# Altium schematic sheet 02_XEM.SchDoc: XEM Card Edge Connector
size 381 x 266 mm; Organization: Meteroi; Address1: Room 428, 410 Guiping Rd.; Address2: Shanghai 200233, CHINA; SheetNumber: 2; SheetTotal: 10; PageSetup: Record=PageOptions|CenterHorizontal=True|CenterVertical=True|PrintScale=0.75|XCorrection=1.00|YCorrection=1.00|PrintKind=2|BorderSize=5000000|LeftOffset=0|BottomOffset=0|Orientation=2|PaperLength=1000|PaperWidth=1000|Scale=100|PaperSource=276|PrintQuality=-3|MediaType=1|DitherType=10|PaperKind=A4|PrintScaleMode=1
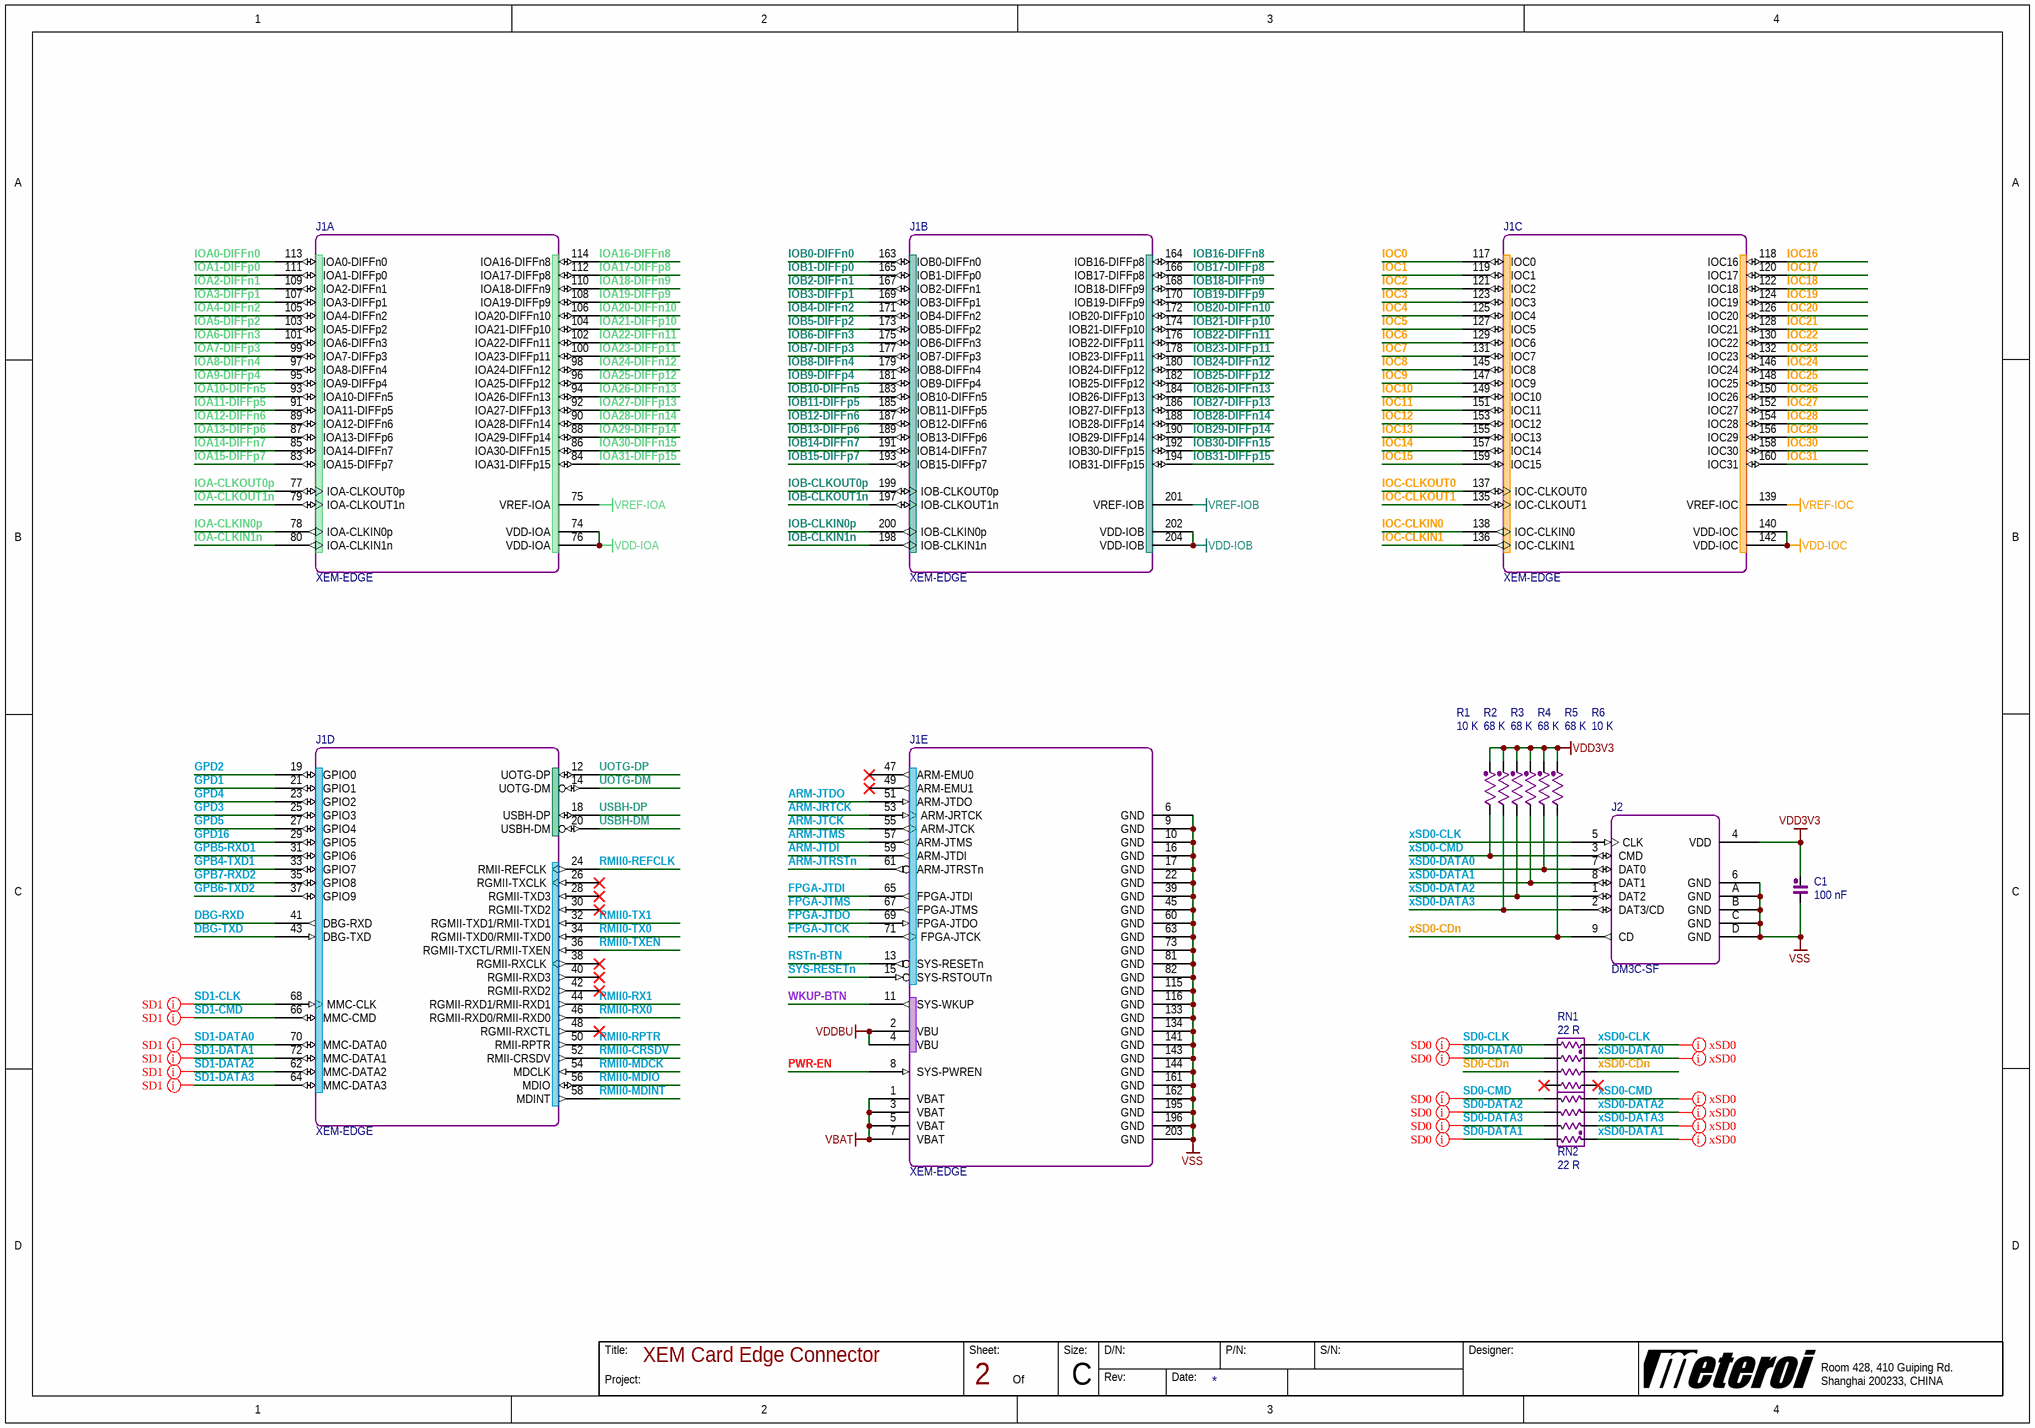
[diagram p0: 02_XEM.SchDoc]

## Parts
C1  100 nF  [0402A1]
J1  XEM-EDGE  [XEM-1C-204]  (parts A,B,C,D,E of 5)
J2  DM3C-SF  [DM3C-SF]
R1  10 K  [0402A2]
R2  68 K  [0402A2]
R3  68 K  [0402A2]
R4  68 K  [0402A2]
R5  68 K  [0402A2]
R6  10 K  [0402A2]
RN1  22 R  [0402PR4]
RN2  22 R  [0402PR4]

## Nets
VBAT: J1.1(VBAT) J1.3(VBAT) J1.5(VBAT) J1.7(VBAT)
VDD3V3: C1.2 J2.4(VDD) R1.2 R2.2 R3.2 R4.2 R5.2 R6.2
VDD-IOA: J1.74(VDD-IOA) J1.76(VDD-IOA)
VDD-IOB: J1.202(VDD-IOB) J1.204(VDD-IOB)
VDD-IOC: J1.140(VDD-IOC) J1.142(VDD-IOC)
VDDBU: J1.2(VBU) J1.4(VBU)
VREF-IOA: J1.75(VREF-IOA)
VREF-IOB: J1.201(VREF-IOB)
VREF-IOC: J1.139(VREF-IOC)
VSS: C1.1 J1.6(GND) J1.9(GND) J1.10(GND) J1.16(GND) J1.17(GND) J1.22(GND) J1.39(GND) J1.45(GND) J1.60(GND) J1.63(GND) J1.73(GND) J1.81(GND) J1.82(GND) J1.115(GND) J1.116(GND) J1.133(GND) J1.134(GND) J1.141(GND) J1.143(GND) J1.144(GND) J1.161(GND) J1.162(GND) J1.195(GND) J1.196(GND) J1.203(GND) J2.6(GND) J2.A(GND) J2.B(GND) J2.C(GND) J2.D(GND)
ARM-JRTCK: J1.53(ARM-JRTCK)
ARM-JTCK: J1.55(ARM-JTCK)
ARM-JTDI: J1.59(ARM-JTDI)
ARM-JTDO: J1.51(ARM-JTDO)
ARM-JTMS: J1.57(ARM-JTMS)
ARM-JTRSTn: J1.61(ARM-JTRSTn)
DBG-RXD: J1.41(DBG-RXD)
DBG-TXD: J1.43(DBG-TXD)
FPGA-JTCK: J1.71(FPGA-JTCK)
FPGA-JTDI: J1.65(FPGA-JTDI)
FPGA-JTDO: J1.69(FPGA-JTDO)
FPGA-JTMS: J1.67(FPGA-JTMS)
GPB4-TXD1: J1.33(GPIO7)
GPB5-RXD1: J1.31(GPIO6)
GPB6-TXD2: J1.37(GPIO9)
GPB7-RXD2: J1.35(GPIO8)
GPD1: J1.21(GPIO1)
GPD2: J1.19(GPIO0)
GPD3: J1.25(GPIO3)
GPD4: J1.23(GPIO2)
GPD5: J1.27(GPIO4)
GPD16: J1.29(GPIO5)
IOA0-DIFFn0: J1.113(IOA0-DIFFn0)
IOA1-DIFFp0: J1.111(IOA1-DIFFp0)
IOA2-DIFFn1: J1.109(IOA2-DIFFn1)
IOA3-DIFFp1: J1.107(IOA3-DIFFp1)
IOA4-DIFFn2: J1.105(IOA4-DIFFn2)
IOA5-DIFFp2: J1.103(IOA5-DIFFp2)
IOA6-DIFFn3: J1.101(IOA6-DIFFn3)
IOA7-DIFFp3: J1.99(IOA7-DIFFp3)
IOA8-DIFFn4: J1.97(IOA8-DIFFn4)
IOA9-DIFFp4: J1.95(IOA9-DIFFp4)
IOA10-DIFFn5: J1.93(IOA10-DIFFn5)
IOA11-DIFFp5: J1.91(IOA11-DIFFp5)
IOA12-DIFFn6: J1.89(IOA12-DIFFn6)
IOA13-DIFFp6: J1.87(IOA13-DIFFp6)
IOA14-DIFFn7: J1.85(IOA14-DIFFn7)
IOA15-DIFFp7: J1.83(IOA15-DIFFp7)
IOA16-DIFFn8: J1.114(IOA16-DIFFn8)
IOA17-DIFFp8: J1.112(IOA17-DIFFp8)
IOA18-DIFFn9: J1.110(IOA18-DIFFn9)
IOA19-DIFFp9: J1.108(IOA19-DIFFp9)
IOA20-DIFFn10: J1.106(IOA20-DIFFn10)
IOA21-DIFFp10: J1.104(IOA21-DIFFp10)
IOA22-DIFFn11: J1.102(IOA22-DIFFn11)
IOA23-DIFFp11: J1.100(IOA23-DIFFp11)
IOA24-DIFFn12: J1.98(IOA24-DIFFn12)
IOA25-DIFFp12: J1.96(IOA25-DIFFp12)
IOA26-DIFFn13: J1.94(IOA26-DIFFn13)
IOA27-DIFFp13: J1.92(IOA27-DIFFp13)
IOA28-DIFFn14: J1.90(IOA28-DIFFn14)
IOA29-DIFFp14: J1.88(IOA29-DIFFp14)
IOA30-DIFFn15: J1.86(IOA30-DIFFn15)
IOA31-DIFFp15: J1.84(IOA31-DIFFp15)
IOA-CLKIN0p: J1.78(IOA-CLKIN0p)
IOA-CLKIN1n: J1.80(IOA-CLKIN1n)
IOA-CLKOUT0p: J1.77(IOA-CLKOUT0p)
IOA-CLKOUT1n: J1.79(IOA-CLKOUT1n)
IOB0-DIFFn0: J1.163(IOB0-DIFFn0)
IOB1-DIFFp0: J1.165(IOB1-DIFFp0)
IOB2-DIFFn1: J1.167(IOB2-DIFFn1)
IOB3-DIFFp1: J1.169(IOB3-DIFFp1)
IOB4-DIFFn2: J1.171(IOB4-DIFFn2)
IOB5-DIFFp2: J1.173(IOB5-DIFFp2)
IOB6-DIFFn3: J1.175(IOB6-DIFFn3)
IOB7-DIFFp3: J1.177(IOB7-DIFFp3)
IOB8-DIFFn4: J1.179(IOB8-DIFFn4)
IOB9-DIFFp4: J1.181(IOB9-DIFFp4)
IOB10-DIFFn5: J1.183(IOB10-DIFFn5)
IOB11-DIFFp5: J1.185(IOB11-DIFFp5)
IOB12-DIFFn6: J1.187(IOB12-DIFFn6)
IOB13-DIFFp6: J1.189(IOB13-DIFFp6)
IOB14-DIFFn7: J1.191(IOB14-DIFFn7)
IOB15-DIFFp7: J1.193(IOB15-DIFFp7)
IOB16-DIFFn8: J1.164(IOB16-DIFFp8)
IOB17-DIFFp8: J1.166(IOB17-DIFFp8)
IOB18-DIFFn9: J1.168(IOB18-DIFFp9)
IOB19-DIFFp9: J1.170(IOB19-DIFFp9)
IOB20-DIFFn10: J1.172(IOB20-DIFFp10)
IOB21-DIFFp10: J1.174(IOB21-DIFFp10)
IOB22-DIFFn11: J1.176(IOB22-DIFFp11)
IOB23-DIFFp11: J1.178(IOB23-DIFFp11)
IOB24-DIFFn12: J1.180(IOB24-DIFFp12)
IOB25-DIFFp12: J1.182(IOB25-DIFFp12)
IOB26-DIFFn13: J1.184(IOB26-DIFFp13)
IOB27-DIFFp13: J1.186(IOB27-DIFFp13)
IOB28-DIFFn14: J1.188(IOB28-DIFFp14)
IOB29-DIFFp14: J1.190(IOB29-DIFFp14)
IOB30-DIFFn15: J1.192(IOB30-DIFFp15)
IOB31-DIFFp15: J1.194(IOB31-DIFFp15)
IOB-CLKIN0p: J1.200(IOB-CLKIN0p)
IOB-CLKIN1n: J1.198(IOB-CLKIN1n)
IOB-CLKOUT0p: J1.199(IOB-CLKOUT0p)
IOB-CLKOUT1n: J1.197(IOB-CLKOUT1n)
IOC0: J1.117(IOC0)
IOC1: J1.119(IOC1)
IOC2: J1.121(IOC2)
IOC3: J1.123(IOC3)
IOC4: J1.125(IOC4)
IOC5: J1.127(IOC5)
IOC6: J1.129(IOC6)
IOC7: J1.131(IOC7)
IOC8: J1.145(IOC8)
IOC9: J1.147(IOC9)
IOC10: J1.149(IOC10)
IOC11: J1.151(IOC11)
IOC12: J1.153(IOC12)
IOC13: J1.155(IOC13)
IOC14: J1.157(IOC14)
IOC15: J1.159(IOC15)
IOC16: J1.118(IOC16)
IOC17: J1.120(IOC17)
IOC18: J1.122(IOC18)
IOC19: J1.124(IOC19)
IOC20: J1.126(IOC20)
IOC21: J1.128(IOC21)
IOC22: J1.130(IOC22)
IOC23: J1.132(IOC23)
IOC24: J1.146(IOC24)
IOC25: J1.148(IOC25)
IOC26: J1.150(IOC26)
IOC27: J1.152(IOC27)
IOC28: J1.154(IOC28)
IOC29: J1.156(IOC29)
IOC30: J1.158(IOC30)
IOC31: J1.160(IOC31)
IOC-CLKIN0: J1.138(IOC-CLKIN0)
IOC-CLKIN1: J1.136(IOC-CLKIN1)
IOC-CLKOUT0: J1.137(IOC-CLKOUT0)
IOC-CLKOUT1: J1.135(IOC-CLKOUT1)
PWR-EN: J1.8(SYS-PWREN)
RMII0-CRSDV: J1.52(RMII-CRSDV)
RMII0-MDCK: J1.54(MDCLK)
RMII0-MDINT: J1.58(MDINT)
RMII0-MDIO: J1.56(MDIO)
RMII0-REFCLK: J1.24(RMII-REFCLK)
RMII0-RPTR: J1.50(RMII-RPTR)
RMII0-RX0: J1.46(RGMII-RXD0/RMII-RXD0)
RMII0-RX1: J1.44(RGMII-RXD1/RMII-RXD1)
RMII0-TX0: J1.34(RGMII-TXD0/RMII-TXD0)
RMII0-TX1: J1.32(RGMII-TXD1/RMII-TXD1)
RMII0-TXEN: J1.36(RGMII-TXCTL/RMII-TXEN)
RSTn-BTN: J1.13(SYS-RESETn)
SD0-CDn: RN1.6
SD0-CLK: RN1.2
SD0-CMD: RN2.8
SD0-DATA0: RN1.4
SD0-DATA1: RN2.2
SD0-DATA2: RN2.6
SD0-DATA3: RN2.4
SD1-CLK: J1.68(MMC-CLK)
SD1-CMD: J1.66(MMC-CMD)
SD1-DATA0: J1.70(MMC-DATA0)
SD1-DATA1: J1.72(MMC-DATA1)
SD1-DATA2: J1.62(MMC-DATA2)
SD1-DATA3: J1.64(MMC-DATA3)
SYS-RESETn: J1.15(SYS-RSTOUTn)
UOTG-DM: J1.14(UOTG-DM)
UOTG-DP: J1.12(UOTG-DP)
USBH-DM: J1.20(USBH-DM)
USBH-DP: J1.18(USBH-DP)
WKUP-BTN: J1.11(SYS-WKUP)
xSD0-CDn: J2.9(CD) R6.1 RN1.5
xSD0-CLK: J2.5(CLK) RN1.1
xSD0-CMD: J2.3(CMD) R1.1 RN2.7
xSD0-DATA0: J2.7(DAT0) R5.1 RN1.3
xSD0-DATA1: J2.8(DAT1) R4.1 RN2.1
xSD0-DATA2: J2.1(DAT2) R3.1 RN2.5
xSD0-DATA3: J2.2(DAT3/CD) R2.1 RN2.3

Not connected (* = marked no-connect by the designer): J1 26(RGMII-TXCLK)* 28(RGMII-TXD3)* 30(RGMII-TXD2)* 38(RGMII-RXCLK)* 40(RGMII-RXD3)* 42(RGMII-RXD2)* 47(ARM-EMU0)* 48(RGMII-RXCTL)* 49(ARM-EMU1)*; RN1 7* 8*

## Layout directives
net class xSD0: xSD0-CLK, xSD0-CMD, xSD0-DATA0, xSD0-DATA1, xSD0-DATA2, xSD0-DATA3
net class SD0: SD0-CLK, SD0-CMD, SD0-DATA0, SD0-DATA1, SD0-DATA2, SD0-DATA3
net class SD1: SD1-CLK, SD1-CMD, SD1-DATA0, SD1-DATA1, SD1-DATA2, SD1-DATA3

## Notes on the sheet
- Title:
- Project:
- Sheet:
- Of
- Size:
- D/N:
- Rev:
- Date:
- P/N:
- S/N:
- Designer:
- C

## Library data of the parts
C1 = CAP: Normal Capacitor; PartNumber: 0; Vendor: muRata; Designer: shyul; PinCountSMD: 2; Value: 100 nF; SerialNumber: 0; Publisher: Cowin; PCBMarker: Capacitor; Version: 1.0; VersionDate: 04-27-2011; PinCountHole: 0
J1 = XEM-EDGE: XEM Edge Connector 204-pins; Vendor: Cowin; PinCountSMD: 0; Designer: shyul; Value: XEM-EDGE; PartNumber: XEM-EDGE; Version: 1.0; VersionDate: 03-09-2012; PinCountHole: 0; SerialNumber: 0; Publisher: Cowin; PCBMarker: XEM
J2 = DM3C-SF: Simple Switch 600mA Adjustable; Vendor: Hirose; PinCountSMD: 13; PinCountHole: 0; Designer: shyul; PCBMarker: SDMicro; Value: DM3C-SF; PartNumber: DM3C-SF; Version: 1.0; VersionDate: 02-23-2012; SerialNumber: 0; Publisher: Cowin
R1-R6 = RES: Normal Resistor; PartNumber: 0; Vendor: KOA; Designer: shyul; PinCountSMD: 2; SerialNumber: 0; Version: 1.0; VersionDate: 04-27-2011; PCBMarker: Resistor; Publisher: Cowin; PinCountHole: 0
  R1 R6: Value: 10 K
  R2-R5: Value: 68 K
RN1 RN2 = RES_N4: Resistor Array x4; PartNumber: YC124-JR-0722RL; SerialNumber: 0; Vendor: YAGEO; Designer: shyul; PinCountSMD: 8; Value: 22 R; Version: 1.0; VersionDate: 04-27-2011; Publisher: Cowin; PCBMarker: Resistor Array; PinCountHole: 0